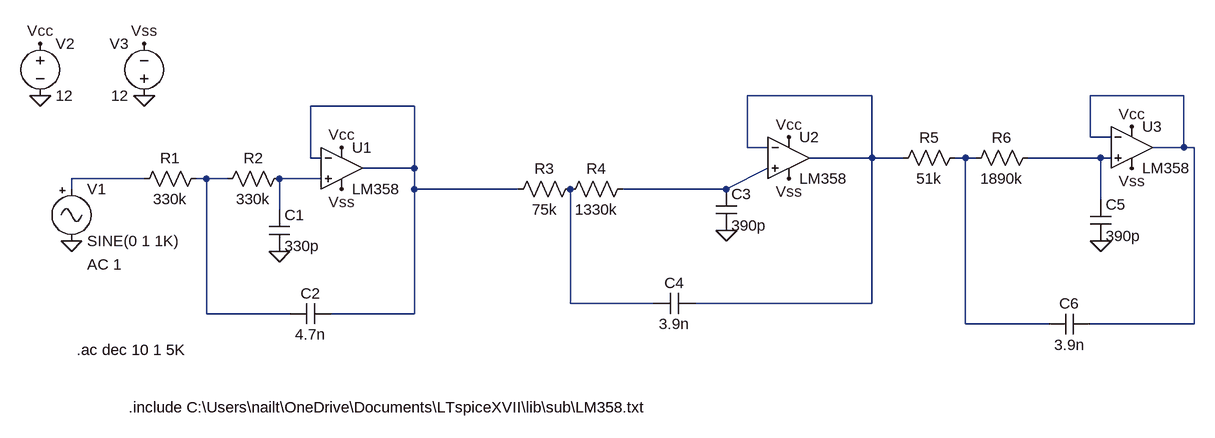
[diagram p0: schematic Low-Pass.asc]
Low-Pass.asc, the LTspice schematic file:
Version 4
SHEET 1 1348 680
WIRE 848 48 656 48
WIRE 1328 48 1184 48
WIRE 144 64 -16 64
WIRE 1184 112 1184 48
WIRE 1216 112 1184 112
WIRE 656 128 656 48
WIRE 688 128 656 128
WIRE 1328 128 1328 48
WIRE 1328 128 1280 128
WIRE 1344 128 1328 128
WIRE -16 144 -16 64
WIRE 0 144 -16 144
WIRE 848 144 848 48
WIRE 848 144 752 144
WIRE 896 144 848 144
WIRE 992 144 976 144
WIRE 1008 144 992 144
WIRE 1200 144 1088 144
WIRE 1216 144 1200 144
WIRE 144 160 144 64
WIRE 144 160 64 160
WIRE -272 176 -384 176
WIRE -176 176 -192 176
WIRE -144 176 -176 176
WIRE 0 176 -64 176
WIRE -384 192 -384 176
WIRE 144 192 144 160
WIRE 304 192 144 192
WIRE 624 192 688 160
WIRE 624 192 464 192
WIRE 1200 208 1200 144
WIRE -64 224 -64 176
WIRE 384 368 384 192
WIRE 512 368 384 368
WIRE 848 368 848 144
WIRE 848 368 576 368
WIRE -176 384 -176 176
WIRE -48 384 -176 384
WIRE 144 384 144 192
WIRE 144 384 16 384
WIRE 992 400 992 144
WIRE 1120 400 992 400
WIRE 1344 400 1344 128
WIRE 1344 400 1184 400
FLAG 32 128 Vcc
FLAG 32 192 Vss
FLAG 720 112 Vcc
FLAG 720 176 Vss
FLAG 1248 96 Vcc
FLAG 1248 160 Vss
FLAG 624 256 0
FLAG 1200 272 0
FLAG -384 272 0
FLAG -64 288 0
FLAG -432 48 0
FLAG -272 48 0
FLAG -432 -32 Vcc
FLAG -272 -32 Vss
SYMBOL Opamps\\opamp2 32 96 R0
SYMATTR InstName U1
SYMATTR Value LM358
SYMBOL Opamps\\opamp2 720 80 R0
SYMATTR InstName U2
SYMATTR Value LM358
SYMBOL Opamps\\opamp2 1248 64 R0
SYMATTR InstName U3
SYMATTR Value LM358
SYMBOL cap 608 192 R0
SYMATTR InstName C3
SYMATTR Value 390p
SYMBOL res 480 176 R90
WINDOW 0 0 56 VBottom 2
WINDOW 3 32 56 VTop 2
SYMATTR InstName R4
SYMATTR Value 1330k
SYMBOL cap 576 352 R90
WINDOW 0 0 32 VBottom 2
WINDOW 3 32 32 VTop 2
SYMATTR InstName C4
SYMATTR Value 3.9n
SYMBOL res 992 128 R90
WINDOW 0 0 56 VBottom 2
WINDOW 3 32 56 VTop 2
SYMATTR InstName R5
SYMATTR Value 51k
SYMBOL res 1104 128 R90
WINDOW 0 0 56 VBottom 2
WINDOW 3 32 56 VTop 2
SYMATTR InstName R6
SYMATTR Value 1890k
SYMBOL cap 1184 208 R0
SYMATTR InstName C5
SYMATTR Value 390p
SYMBOL cap 1184 384 R90
WINDOW 0 0 32 VBottom 2
WINDOW 3 32 32 VTop 2
SYMATTR InstName C6
SYMATTR Value 3.9n
SYMBOL Misc\\signal -384 176 R0
WINDOW 123 24 132 Left 2
WINDOW 39 0 0 Left 2
SYMATTR Value2 AC 1
SYMATTR InstName V1
SYMBOL res 400 176 R90
WINDOW 0 0 56 VBottom 2
WINDOW 3 32 56 VTop 2
SYMATTR InstName R3
SYMATTR Value 75k
SYMBOL cap -80 224 R0
SYMATTR InstName C1
SYMATTR Value 330p
SYMBOL res -48 160 R90
WINDOW 0 0 56 VBottom 2
WINDOW 3 32 56 VTop 2
SYMATTR InstName R2
SYMATTR Value 330k
SYMBOL res -176 160 R90
WINDOW 0 0 56 VBottom 2
WINDOW 3 32 56 VTop 2
SYMATTR InstName R1
SYMATTR Value 330k
SYMBOL cap 16 368 R90
WINDOW 0 0 32 VBottom 2
WINDOW 3 32 32 VTop 2
SYMATTR InstName C2
SYMATTR Value 4.7n
SYMBOL voltage -432 -48 R0
WINDOW 123 0 0 Left 2
WINDOW 39 0 0 Left 2
SYMATTR InstName V2
SYMATTR Value 12
SYMBOL voltage -272 64 R180
WINDOW 0 24 96 Left 2
WINDOW 3 24 16 Left 2
WINDOW 123 0 0 Left 2
WINDOW 39 0 0 Left 2
SYMATTR InstName V3
SYMATTR Value 12
TEXT -296 528 Left 2 !.include C:\\Users\\nailt\\OneDrive\\Documents\\LTspiceXVII\\lib\\sub\\LM358.txt
TEXT -376 440 Left 2 !.ac dec 10 1 5K

The netlist it stands for:
* Low-Pass.asc
XU1 N008 N003 Vcc Vss N003 LM358  ; pins In+ In- V+ V- OUT
XU2 N009 N001 Vcc Vss N001 LM358  ; pins In+ In- V+ V- OUT
XU3 N005 N002 Vcc Vss N002 LM358  ; pins In+ In- V+ V- OUT
C3 N009 0 390p
R4 N009 N010 1330k
C4 N001 N010 3.9n
R5 N004 N001 51k
R6 N005 N004 1890k
C5 N005 0 390p
C6 N002 N004 3.9n
V1 N006 0 SINE(0 1 1K) AC 1
R3 N010 N003 75k
C1 N008 0 330p
R2 N008 N007 330k
R1 N007 N006 330k
C2 N003 N007 4.7n
V2 Vcc 0 12
V3 0 Vss 12
.include C:\Users\nailt\OneDrive\Documents\LTspiceXVII\lib\sub\LM358.txt
.ac dec 10 1 5K
.backanno
.end